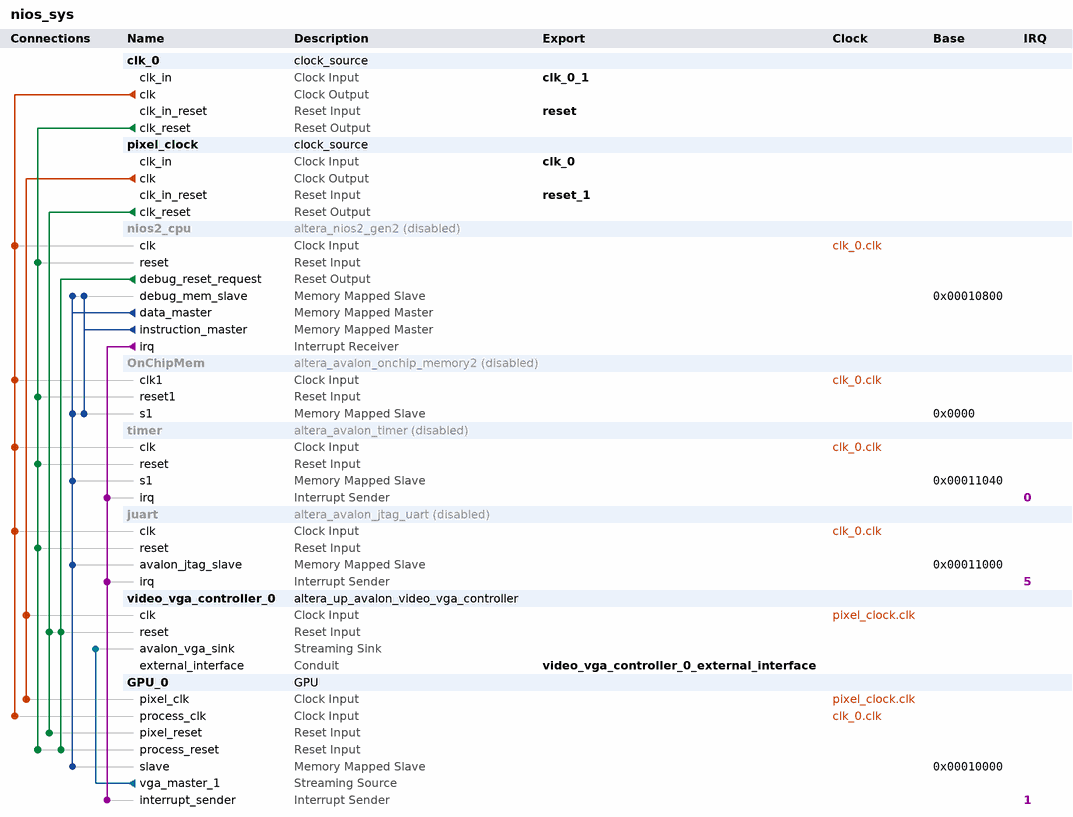
[diagram p0: system contents]
# Platform Designer (Qsys) system nios_sys, Cyclone V 5CSEMA5F31C6
# Parameters at their usual value, and those the tool derives, are not listed.
package require -exact qsys 21.1
create_system nios_sys
set_project_property DEVICE_FAMILY {Cyclone V}
set_project_property DEVICE 5CSEMA5F31C6

add_instance clk_0 clock_source 21.1
set_instance_parameter_value clk_0 clockFrequency 100000000

add_instance pixel_clock clock_source 21.1
set_instance_parameter_value pixel_clock clockFrequency 40000000

add_instance nios2_cpu altera_nios2_gen2 21.1
set_instance_property nios2_cpu ENABLED false
set_instance_parameter_value nios2_cpu dcache_size 2048
set_instance_parameter_value nios2_cpu exceptionSlave OnChipMem.s1
set_instance_parameter_value nios2_cpu icache_size 4096
set_instance_parameter_value nios2_cpu impl Tiny
set_instance_parameter_value nios2_cpu resetSlave OnChipMem.s1

add_instance OnChipMem altera_avalon_onchip_memory2 21.1
set_instance_property OnChipMem ENABLED false
set_instance_parameter_value OnChipMem dataWidth 32
set_instance_parameter_value OnChipMem dualPort false
set_instance_parameter_value OnChipMem initMemContent true
set_instance_parameter_value OnChipMem initializationFileName onchip_mem.hex
set_instance_parameter_value OnChipMem memorySize 40960

add_instance timer altera_avalon_timer 21.1
set_instance_property timer ENABLED false
set_instance_parameter_value timer period 1
set_instance_parameter_value timer periodUnits MSEC

add_instance juart altera_avalon_jtag_uart 21.1
set_instance_property juart ENABLED false
set_instance_parameter_value juart simInteractiveOptions NO_INTERACTIVE_WINDOWS

add_instance video_vga_controller_0 altera_up_avalon_video_vga_controller 21.1
set_instance_parameter_value video_vga_controller_0 board DE1-SoC
set_instance_parameter_value video_vga_controller_0 resolution {SVGA 800x600}

add_instance GPU_0 GPU 1.0
set_instance_parameter_value GPU_0 COLOR_WIDTH 16
set_instance_parameter_value GPU_0 COORD_WIDTH 16
set_instance_parameter_value GPU_0 CORES_COUNT 1
set_instance_parameter_value GPU_0 MADDR_WIDTH 32
set_instance_parameter_value GPU_0 SADDR_WIDTH 32
set_instance_parameter_value GPU_0 SCREEN_X_SIZE 640
set_instance_parameter_value GPU_0 SCREEN_Y_SIZE 480
set_instance_parameter_value GPU_0 VERTEX_SIZE 6

# connections
add_connection clk_0.clk GPU_0.process_clk clock
add_connection clk_0.clk juart.clk clock
add_connection clk_0.clk nios2_cpu.clk clock
add_connection clk_0.clk OnChipMem.clk1 clock
add_connection clk_0.clk timer.clk clock
add_connection pixel_clock.clk GPU_0.pixel_clk clock
add_connection pixel_clock.clk video_vga_controller_0.clk clock
add_connection clk_0.clk_reset GPU_0.process_reset reset
add_connection clk_0.clk_reset juart.reset reset
add_connection clk_0.clk_reset nios2_cpu.reset reset
add_connection clk_0.clk_reset OnChipMem.reset1 reset
add_connection clk_0.clk_reset timer.reset reset
add_connection nios2_cpu.debug_reset_request GPU_0.process_reset reset
add_connection nios2_cpu.debug_reset_request video_vga_controller_0.reset reset
add_connection pixel_clock.clk_reset GPU_0.pixel_reset reset
add_connection pixel_clock.clk_reset video_vga_controller_0.reset reset
add_connection nios2_cpu.data_master GPU_0.slave avalon
set_connection_parameter_value nios2_cpu.data_master/GPU_0.slave baseAddress 0x00010000
add_connection nios2_cpu.data_master juart.avalon_jtag_slave avalon
set_connection_parameter_value nios2_cpu.data_master/juart.avalon_jtag_slave baseAddress 0x00011000
add_connection nios2_cpu.data_master nios2_cpu.debug_mem_slave avalon
set_connection_parameter_value nios2_cpu.data_master/nios2_cpu.debug_mem_slave baseAddress 0x00010800
add_connection nios2_cpu.data_master OnChipMem.s1 avalon
set_connection_parameter_value nios2_cpu.data_master/OnChipMem.s1 baseAddress 0x0000
add_connection nios2_cpu.data_master timer.s1 avalon
set_connection_parameter_value nios2_cpu.data_master/timer.s1 baseAddress 0x00011040
add_connection nios2_cpu.instruction_master nios2_cpu.debug_mem_slave avalon
set_connection_parameter_value nios2_cpu.instruction_master/nios2_cpu.debug_mem_slave baseAddress 0x00010800
add_connection nios2_cpu.instruction_master OnChipMem.s1 avalon
set_connection_parameter_value nios2_cpu.instruction_master/OnChipMem.s1 baseAddress 0x0000
add_connection GPU_0.vga_master_1 video_vga_controller_0.avalon_vga_sink avalon_streaming
add_connection nios2_cpu.irq GPU_0.interrupt_sender interrupt
set_connection_parameter_value nios2_cpu.irq/GPU_0.interrupt_sender irqNumber 1
add_connection nios2_cpu.irq juart.irq interrupt
set_connection_parameter_value nios2_cpu.irq/juart.irq irqNumber 5
add_connection nios2_cpu.irq timer.irq interrupt
set_connection_parameter_value nios2_cpu.irq/timer.irq irqNumber 0

# exported interfaces
add_interface clk_0 clock sink
set_interface_property clk_0 EXPORT_OF pixel_clock.clk_in
add_interface clk_0_1 clock sink
set_interface_property clk_0_1 EXPORT_OF clk_0.clk_in
add_interface reset reset sink
set_interface_property reset EXPORT_OF clk_0.clk_in_reset
add_interface reset_1 reset sink
set_interface_property reset_1 EXPORT_OF pixel_clock.clk_in_reset
add_interface video_vga_controller_0_external_interface conduit end
set_interface_property video_vga_controller_0_external_interface EXPORT_OF video_vga_controller_0.external_interface

set_interconnect_requirement {$system} qsys_mm.clockCrossingAdapter HANDSHAKE
set_interconnect_requirement {$system} qsys_mm.enableEccProtection FALSE
set_interconnect_requirement {$system} qsys_mm.insertDefaultSlave FALSE
set_interconnect_requirement {$system} qsys_mm.maxAdditionalLatency 1

save_system nios_sys.qsys
